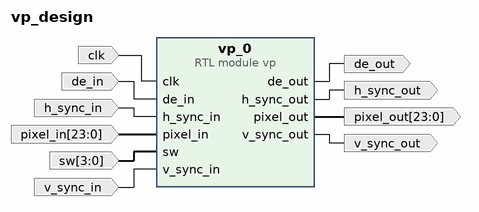
[diagram p0: block diagram of the top level]
# Vivado block design vp_design, xc7z020clg400-1, Vivado 2022.2
create_bd_design vp_design

create_bd_port -dir I -type clk clk
set_property -dict {CONFIG.FREQ_HZ 100000000} [get_bd_ports clk]
create_bd_port -dir I de_in
create_bd_port -dir I h_sync_in
create_bd_port -dir I v_sync_in
create_bd_port -dir I -from 23 -to 0 pixel_in
create_bd_port -dir O de_out
create_bd_port -dir O h_sync_out
create_bd_port -dir O v_sync_out
create_bd_port -dir O -from 23 -to 0 pixel_out
create_bd_port -dir I -from 3 -to 0 sw

create_bd_cell -type module -reference vp vp_0

# ---- connections ----

connect_bd_net [get_bd_ports clk] [get_bd_pins vp_0/clk]
connect_bd_net [get_bd_ports de_in] [get_bd_pins vp_0/de_in]
connect_bd_net [get_bd_ports h_sync_in] [get_bd_pins vp_0/h_sync_in]
connect_bd_net [get_bd_ports pixel_in] [get_bd_pins vp_0/pixel_in]
connect_bd_net [get_bd_ports sw] [get_bd_pins vp_0/sw]
connect_bd_net [get_bd_ports v_sync_in] [get_bd_pins vp_0/v_sync_in]
connect_bd_net [get_bd_pins vp_0/de_out] [get_bd_ports de_out]
connect_bd_net [get_bd_pins vp_0/h_sync_out] [get_bd_ports h_sync_out]
connect_bd_net [get_bd_pins vp_0/pixel_out] [get_bd_ports pixel_out]
connect_bd_net [get_bd_pins vp_0/v_sync_out] [get_bd_ports v_sync_out]

validate_bd_design
save_bd_design
